# EAGLE schematic Telemetry_layoutmain (EAGLE 8.2.1)
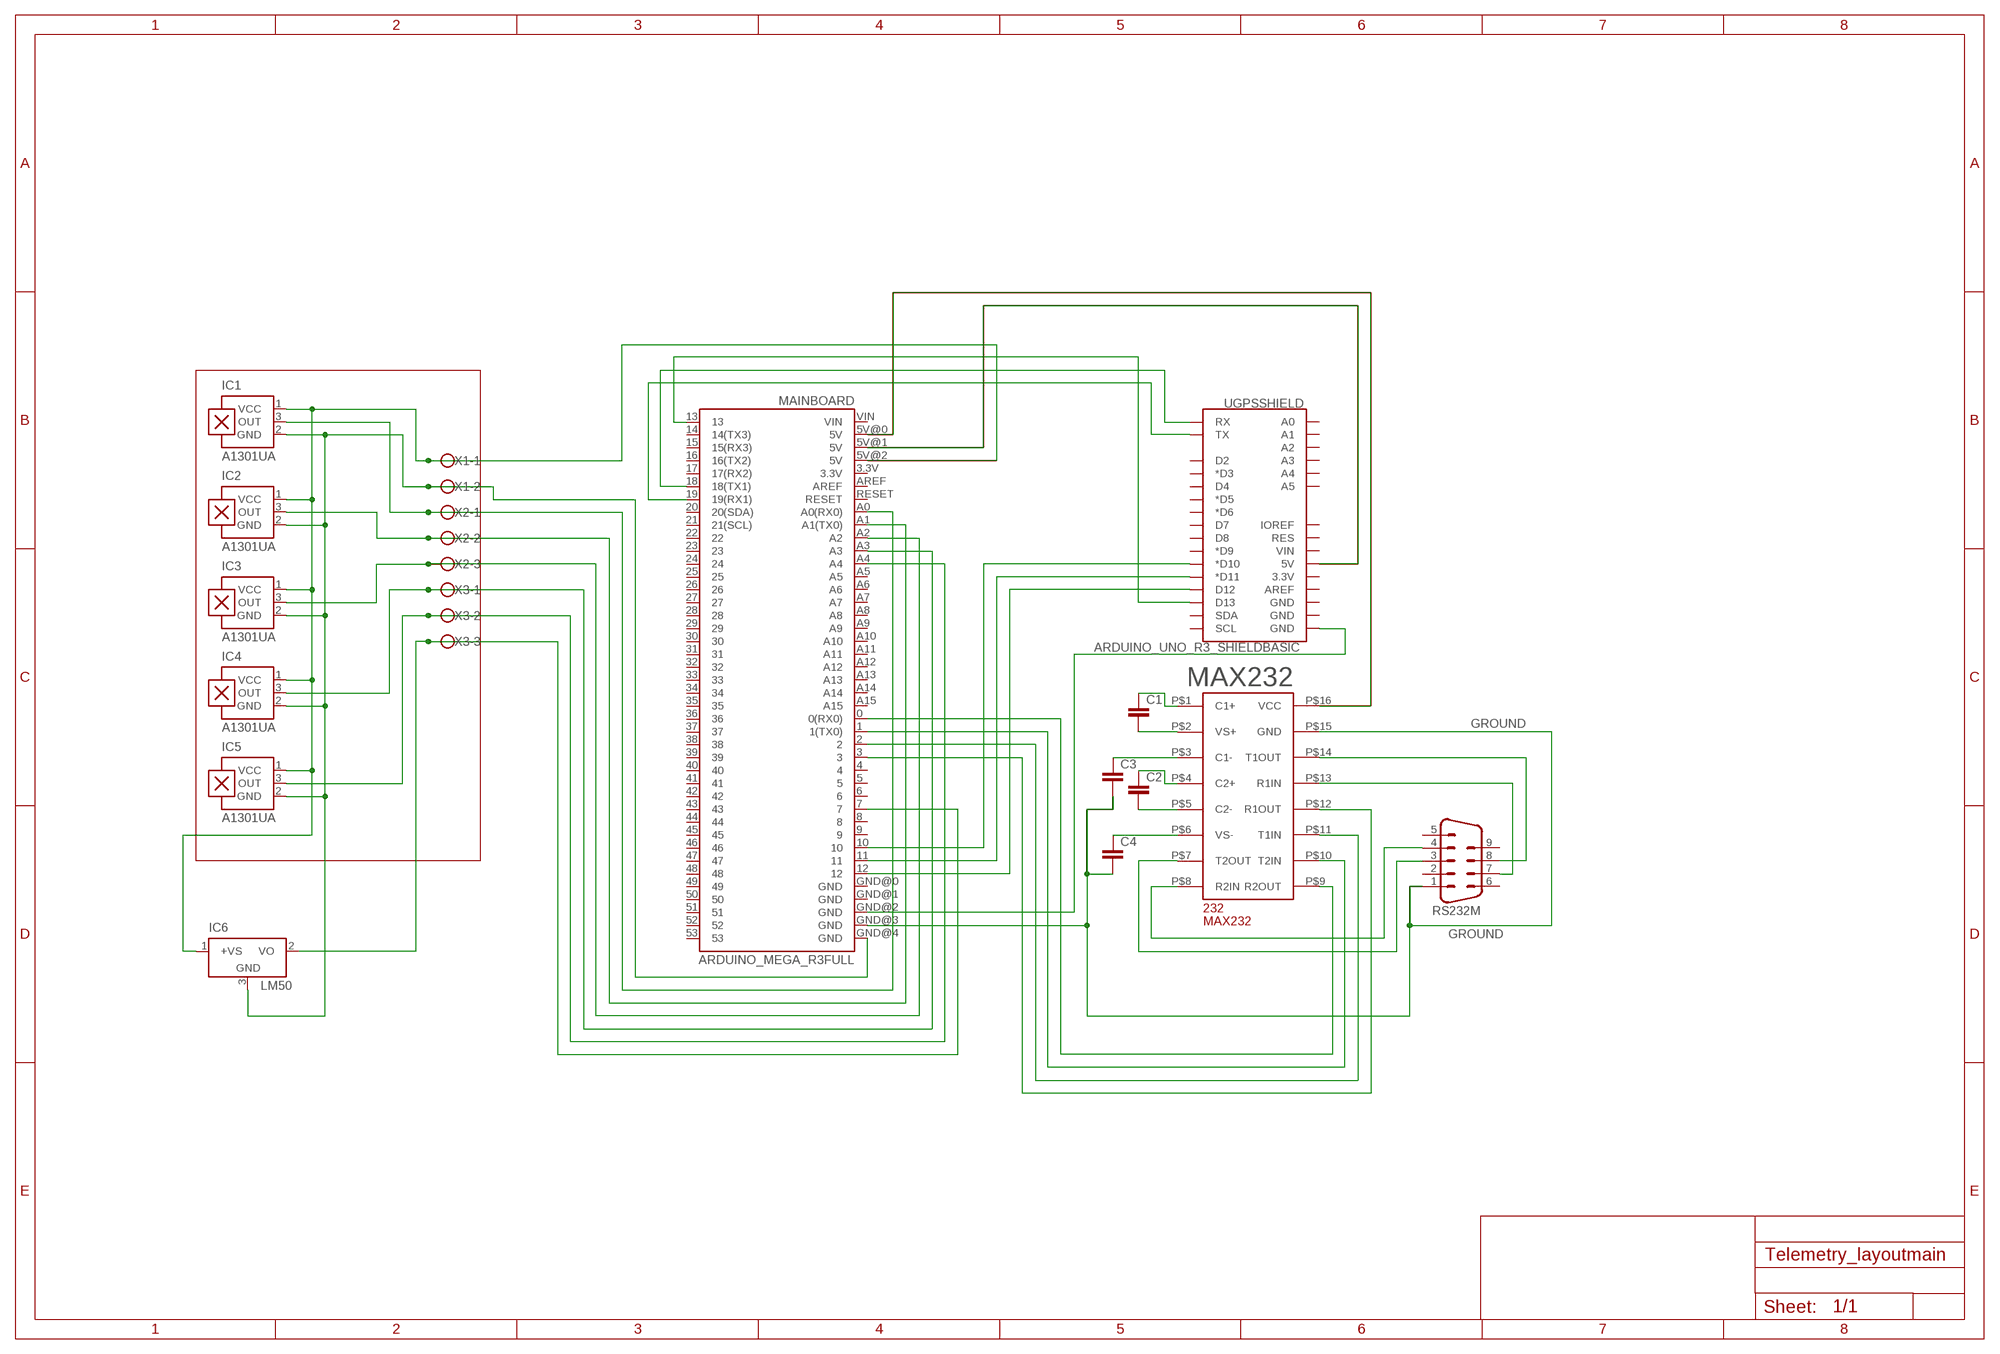
[diagram p0: schematic, sheet 1]

## Parts
232  MAX232TELE  [DIP16]
C1  C2,5-3  [C2.5-3]
C2  C2,5-3  [C2.5-3]
C3  C2,5-3  [C2.5-3]
C4  C2,5-3  [C2.5-3]
IC1  A1301UA  [SIP3-UA]
IC2  A1301UA  [SIP3-UA]
IC3  A1301UA  [SIP3-UA]
IC4  A1301UA  [SIP3-UA]
IC5  A1301UA  [SIP3-UA]
IC6  LM50  [SOT23]
MAINBOARD  ARDUINO_MEGA_R3FULL  [ARDUINO_MEGA]
RS232M  M09HP  [M09HP]
UGPSSHIELD  ARDUINO_UNO_R3_SHIELDBASIC  [UNO_R3_SHIELD]
X1  W237-102  [W237-102]
X2  W237-103  [W237-103]
X3  W237-103  [W237-103]

## Nets
GROUND: 232.P$15(GND) C3.2 C4.2 MAINBOARD.GND@3(GND) RS232M.1
N$1: 232.P$1(C1+) C1.1
N$2: 232.P$2(VS+) C1.2
N$3: 232.P$5(C2-) C2.2
N$4: 232.P$4(C2+) C2.1
N$5: MAINBOARD.19(19(RX1)) UGPSSHIELD.TX
N$6: 232.P$6(VS-) C4.1
N$7: 232.P$14(T1OUT) RS232M.8
N$8: 232.P$13(R1IN) RS232M.7
N$9: 232.P$8(R2IN) RS232M.4
N$10: 232.P$7(T2OUT) RS232M.3
N$11: 232.P$10(T2IN) MAINBOARD.1(1(TX0))
N$12: 232.P$9(R2OUT) MAINBOARD.0(0(RX0))
N$13: 232.P$11(T1IN) MAINBOARD.2
N$14: MAINBOARD.10 UGPSSHIELD.D10(*D10)
N$15: MAINBOARD.11 UGPSSHIELD.D11(*D11)
N$16: MAINBOARD.12 UGPSSHIELD.D12
N$17: MAINBOARD.5V@1(5V) UGPSSHIELD.5V
N$18: 232.P$16(VCC) MAINBOARD.5V@0(5V)
N$20: MAINBOARD.GND@2(GND) UGPSSHIELD.GND@0(GND)
N$21: 232.P$3(C1-) C3.1
N$22: MAINBOARD.18(18(TX1)) UGPSSHIELD.RX
N$23: MAINBOARD.13 UGPSSHIELD.D13
N$25: IC1.3(OUT) MAINBOARD.A0(A0(RX0)) X2.1
N$26: IC2.3(OUT) MAINBOARD.A1(A1(TX0)) X2.2
N$27: IC3.3(OUT) MAINBOARD.A2 X2.3
N$28: IC4.3(OUT) MAINBOARD.A3 X3.1
N$29: IC5.3(OUT) MAINBOARD.A4 X3.2
N$30: IC6.2(VO) MAINBOARD.7 X3.3
N$31: 232.P$12(R1OUT) MAINBOARD.3
N$32: IC1.1(VCC) IC2.1(VCC) IC3.1(VCC) IC4.1(VCC) IC5.1(VCC) IC6.1(+VS) MAINBOARD.5V@2(5V) X1.1
N$34: IC1.2(GND) IC2.2(GND) IC3.2(GND) IC4.2(GND) IC5.2(GND) IC6.3(GND) MAINBOARD.GND@4(GND) X1.2
Unconnected: MAINBOARD.3.3V MAINBOARD.4 MAINBOARD.5 MAINBOARD.6 MAINBOARD.8 MAINBOARD.9 MAINBOARD.14(14(TX3)) MAINBOARD.15(15(RX3)) MAINBOARD.16(16(TX2)) MAINBOARD.17(17(RX2)) MAINBOARD.20(20(SDA)) MAINBOARD.21(21(SCL)) MAINBOARD.22 MAINBOARD.23 MAINBOARD.24 MAINBOARD.25 MAINBOARD.26 MAINBOARD.27 MAINBOARD.28 MAINBOARD.29 MAINBOARD.30 MAINBOARD.31 MAINBOARD.32 MAINBOARD.33 MAINBOARD.34 MAINBOARD.35 MAINBOARD.36 MAINBOARD.37 MAINBOARD.38 MAINBOARD.39 MAINBOARD.40 MAINBOARD.41 MAINBOARD.42 MAINBOARD.43 MAINBOARD.44 MAINBOARD.45 MAINBOARD.46 MAINBOARD.47 MAINBOARD.48 MAINBOARD.49 MAINBOARD.50 MAINBOARD.51 MAINBOARD.52 MAINBOARD.53 MAINBOARD.A5 MAINBOARD.A6 MAINBOARD.A7 MAINBOARD.A8 MAINBOARD.A9 MAINBOARD.A10 MAINBOARD.A11 MAINBOARD.A12 MAINBOARD.A13 MAINBOARD.A14 MAINBOARD.A15 MAINBOARD.AREF MAINBOARD.GND@0(GND) MAINBOARD.GND@1(GND) MAINBOARD.RESET MAINBOARD.VIN RS232M.2 RS232M.5 RS232M.6 RS232M.9 UGPSSHIELD.3.3V UGPSSHIELD.A0 UGPSSHIELD.A1 UGPSSHIELD.A2 UGPSSHIELD.A3 UGPSSHIELD.A4 UGPSSHIELD.A5 UGPSSHIELD.AREF UGPSSHIELD.D2 UGPSSHIELD.D3(*D3) UGPSSHIELD.D4 UGPSSHIELD.D5(*D5) UGPSSHIELD.D6(*D6) UGPSSHIELD.D7 UGPSSHIELD.D8 UGPSSHIELD.D9(*D9) UGPSSHIELD.GND@1(GND) UGPSSHIELD.GND@2(GND) UGPSSHIELD.IOREF UGPSSHIELD.RES UGPSSHIELD.SCL UGPSSHIELD.SDA UGPSSHIELD.VIN

## Notes on the sheet
- MAX232

## Library data of the parts
232 = MAX232TELE:MAX232TELE
C1-C4 = capacitor-wima:C: CAPACITOR naming: grid - package width
IC1-IC5 = allegro:A13*?: Linear Hall Effect Sensor ICs Continuous-Time Ratiometric High-Temperature Operation Programmable Linear with Analog Output A1302 -Replacement- UGN3503 Source: http://www.allegromicro.com/en/Products/Part_Numbers/1301/1301.pdf http://www.allegromicro.com/en/Products/Part_Numbers/1321/1321.pdf http://www.allegromicro.com/en/Products/Part_Numbers/1381/1381.pdf; MF: ALLEGRO MICROSYSTEMS, INC.; MPN: A1301EUA-T; OC_FARNELL: 1198085; OC_NEWARK: 31K6635
IC6 = linear:LM50: SOT-23 Single-Supply Centigrade Temperature Sensor Vout = (10mV/°C x Temp °C) +5mmmV Source: http://cache.national.com/ds/LM/LM50.pdf
MAINBOARD = SparkFun-Boards:ARDUINO_MEGA_R3: Arduino Mega R3 ATmega2560 R3 compatible footprint. SparkFun Products: Arduino Mega 2560 R3 <https://www.sparkfun.com/products/11061>
RS232M = con-subd:M09: SUB-D; OC_FARNELL: unknown; OC_NEWARK: unknown
UGPSSHIELD = SparkFun-Boards:ARDUINO_UNO_R3_SHIELD: Arduino R3 Shield Footprint Shield form compatible with the Arduino Uno R3. SparkFun Products: MG2639 Cellular Shield <https://www.sparkfun.com/products/13120> MIDI Shield <https://www.sparkfun.com/products/12898> R3 Stackable Headers Kit <https://www.sparkfun.com/products/11417>
X1 = con-wago-500:W237-102: WAGO SCREW CLAMP; MPN: 237-102; OC_FARNELL: unknown; OC_NEWARK: 70K9898
X2 X3 = con-wago-500:W237-103: WAGO SCREW CLAMP; MPN: 237-103; OC_FARNELL: unknown; OC_NEWARK: 18M7116